# EasyEDA Pro project STM32H723ZGTx_ADDA.eprj, schematic Schematic1

## Sheets
1 STM32: Board Name: Board1; Create Date: 2025-04-22; Page Name: STM32; Project Name: STM32H723ZGTx_ADDA; Schematic Name: Schematic1; Update Date: 2025-05-30; Company: 嘉立创EDA; Page Size: A4; Version: V1.0
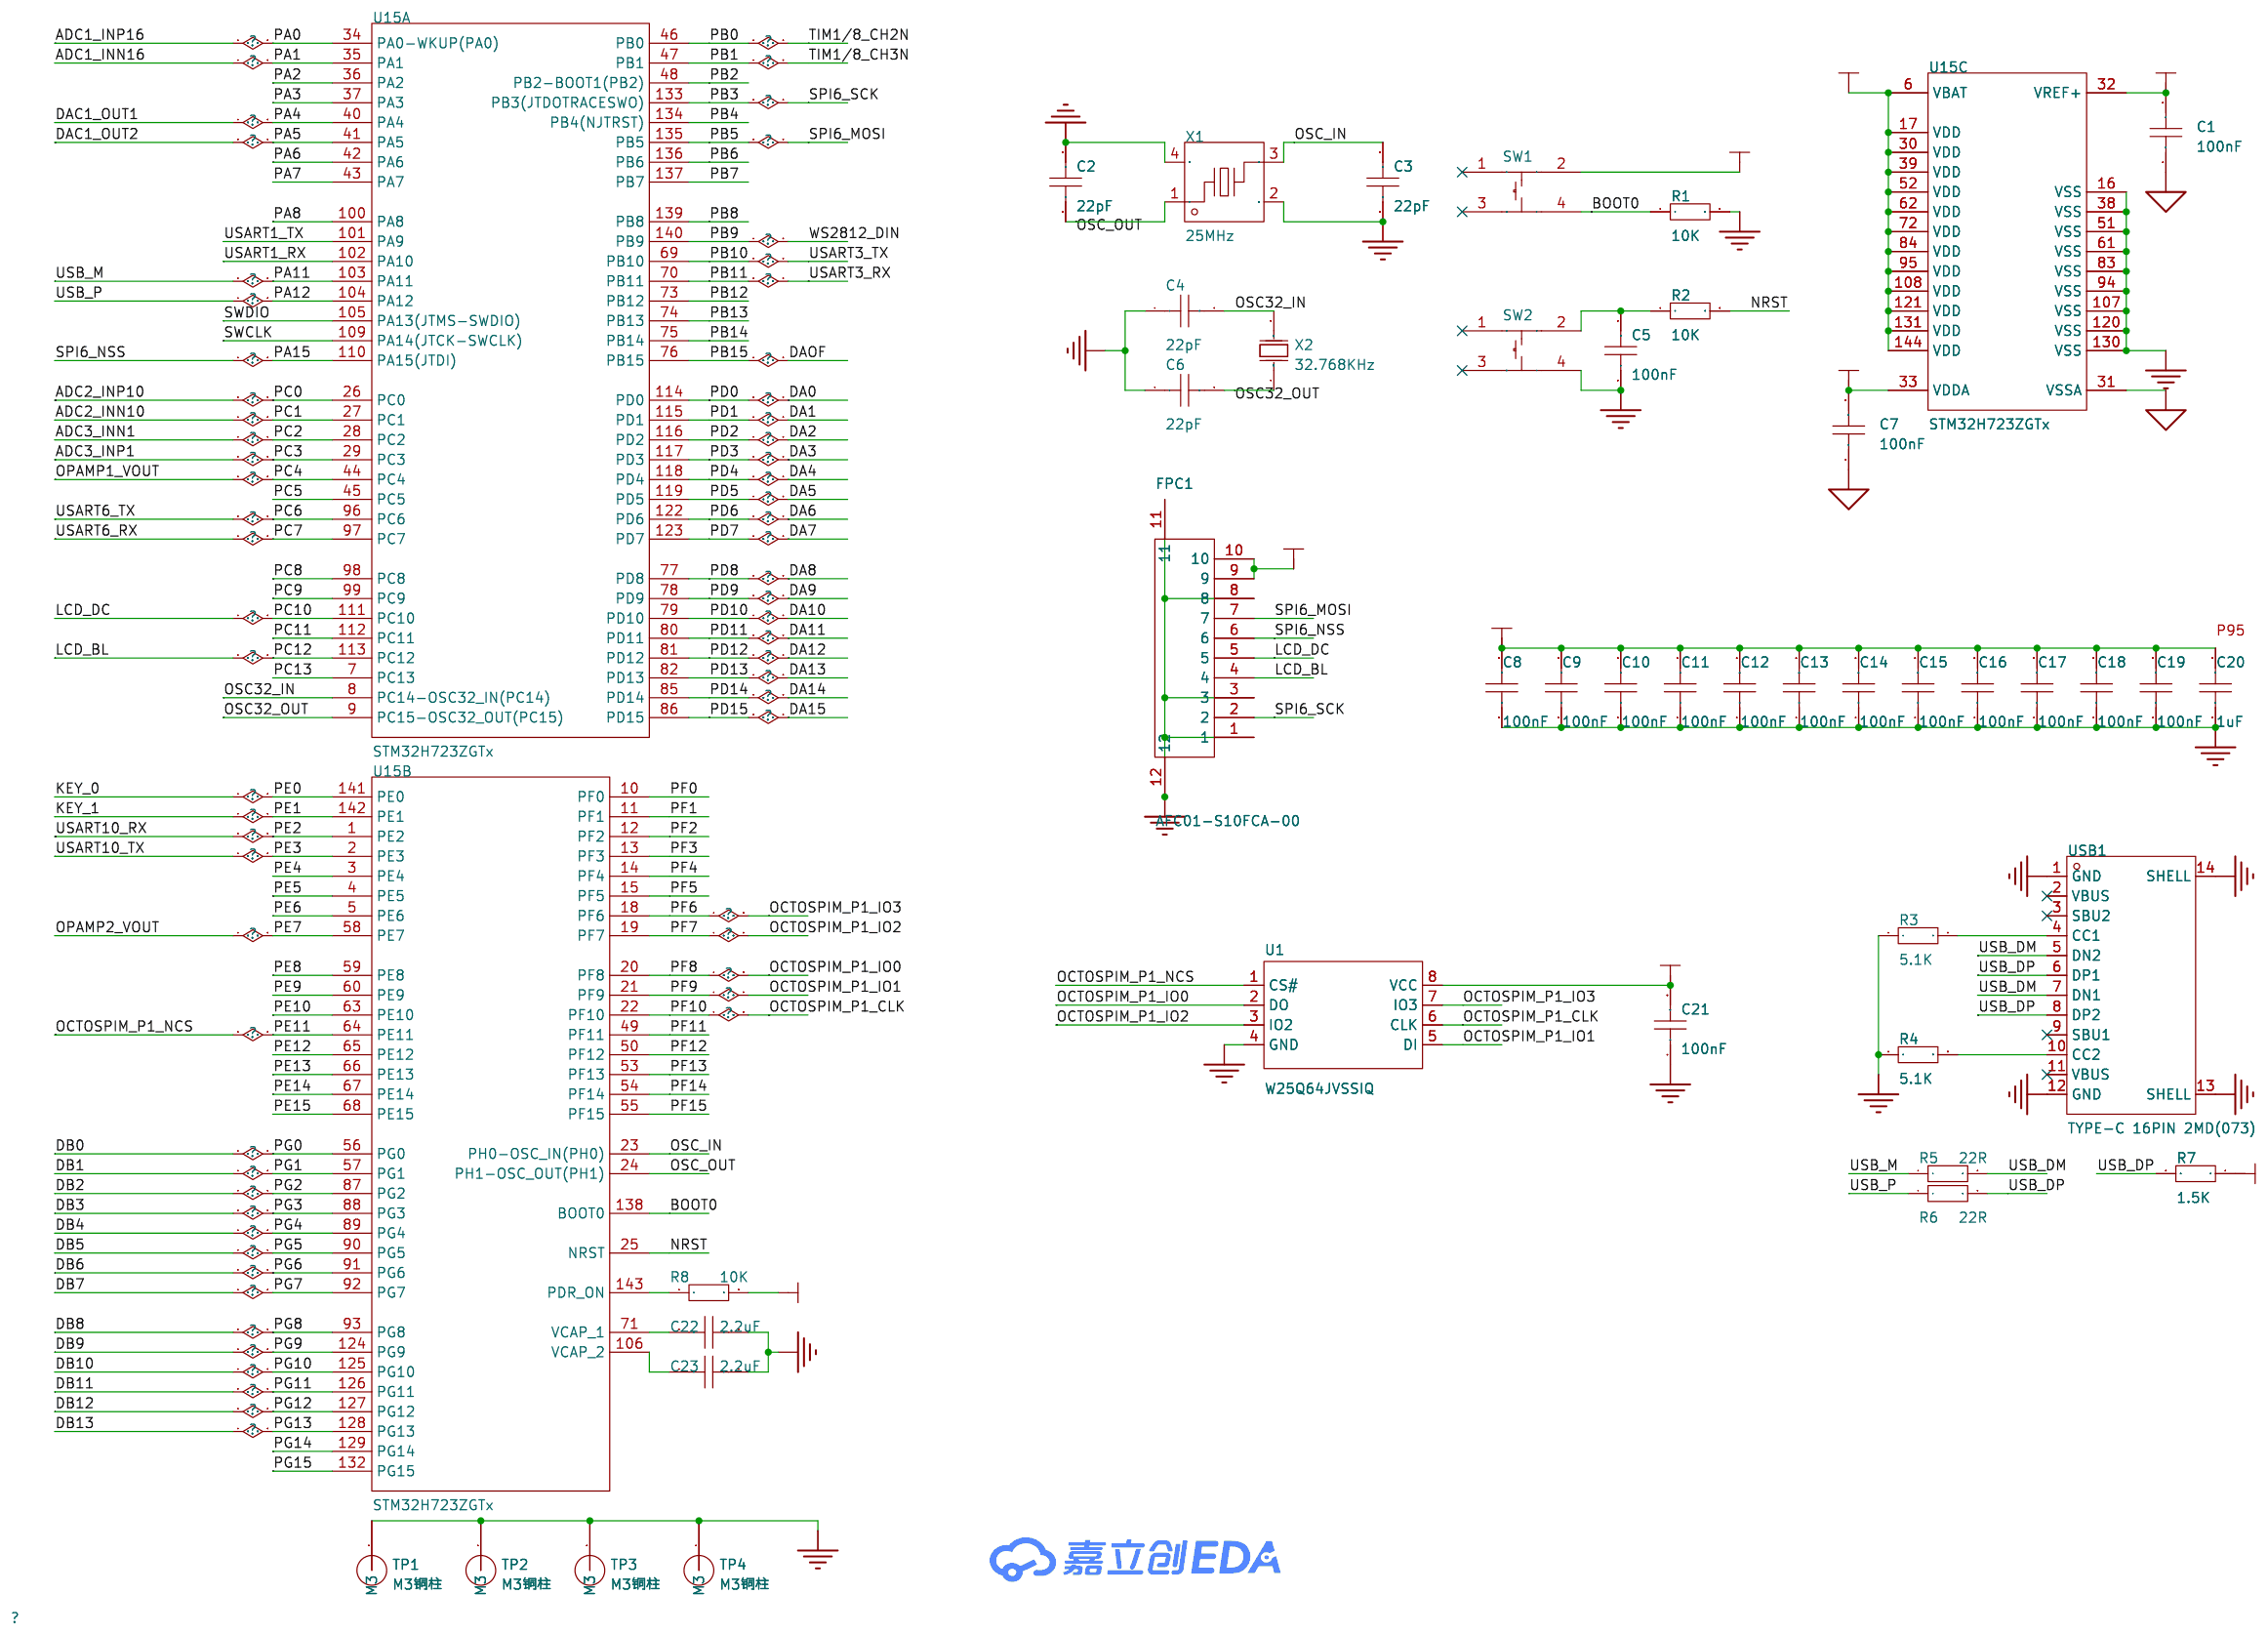
[diagram p0: STM32]
2 POWER: Page Name: POWER; Update Date: 2025-05-24
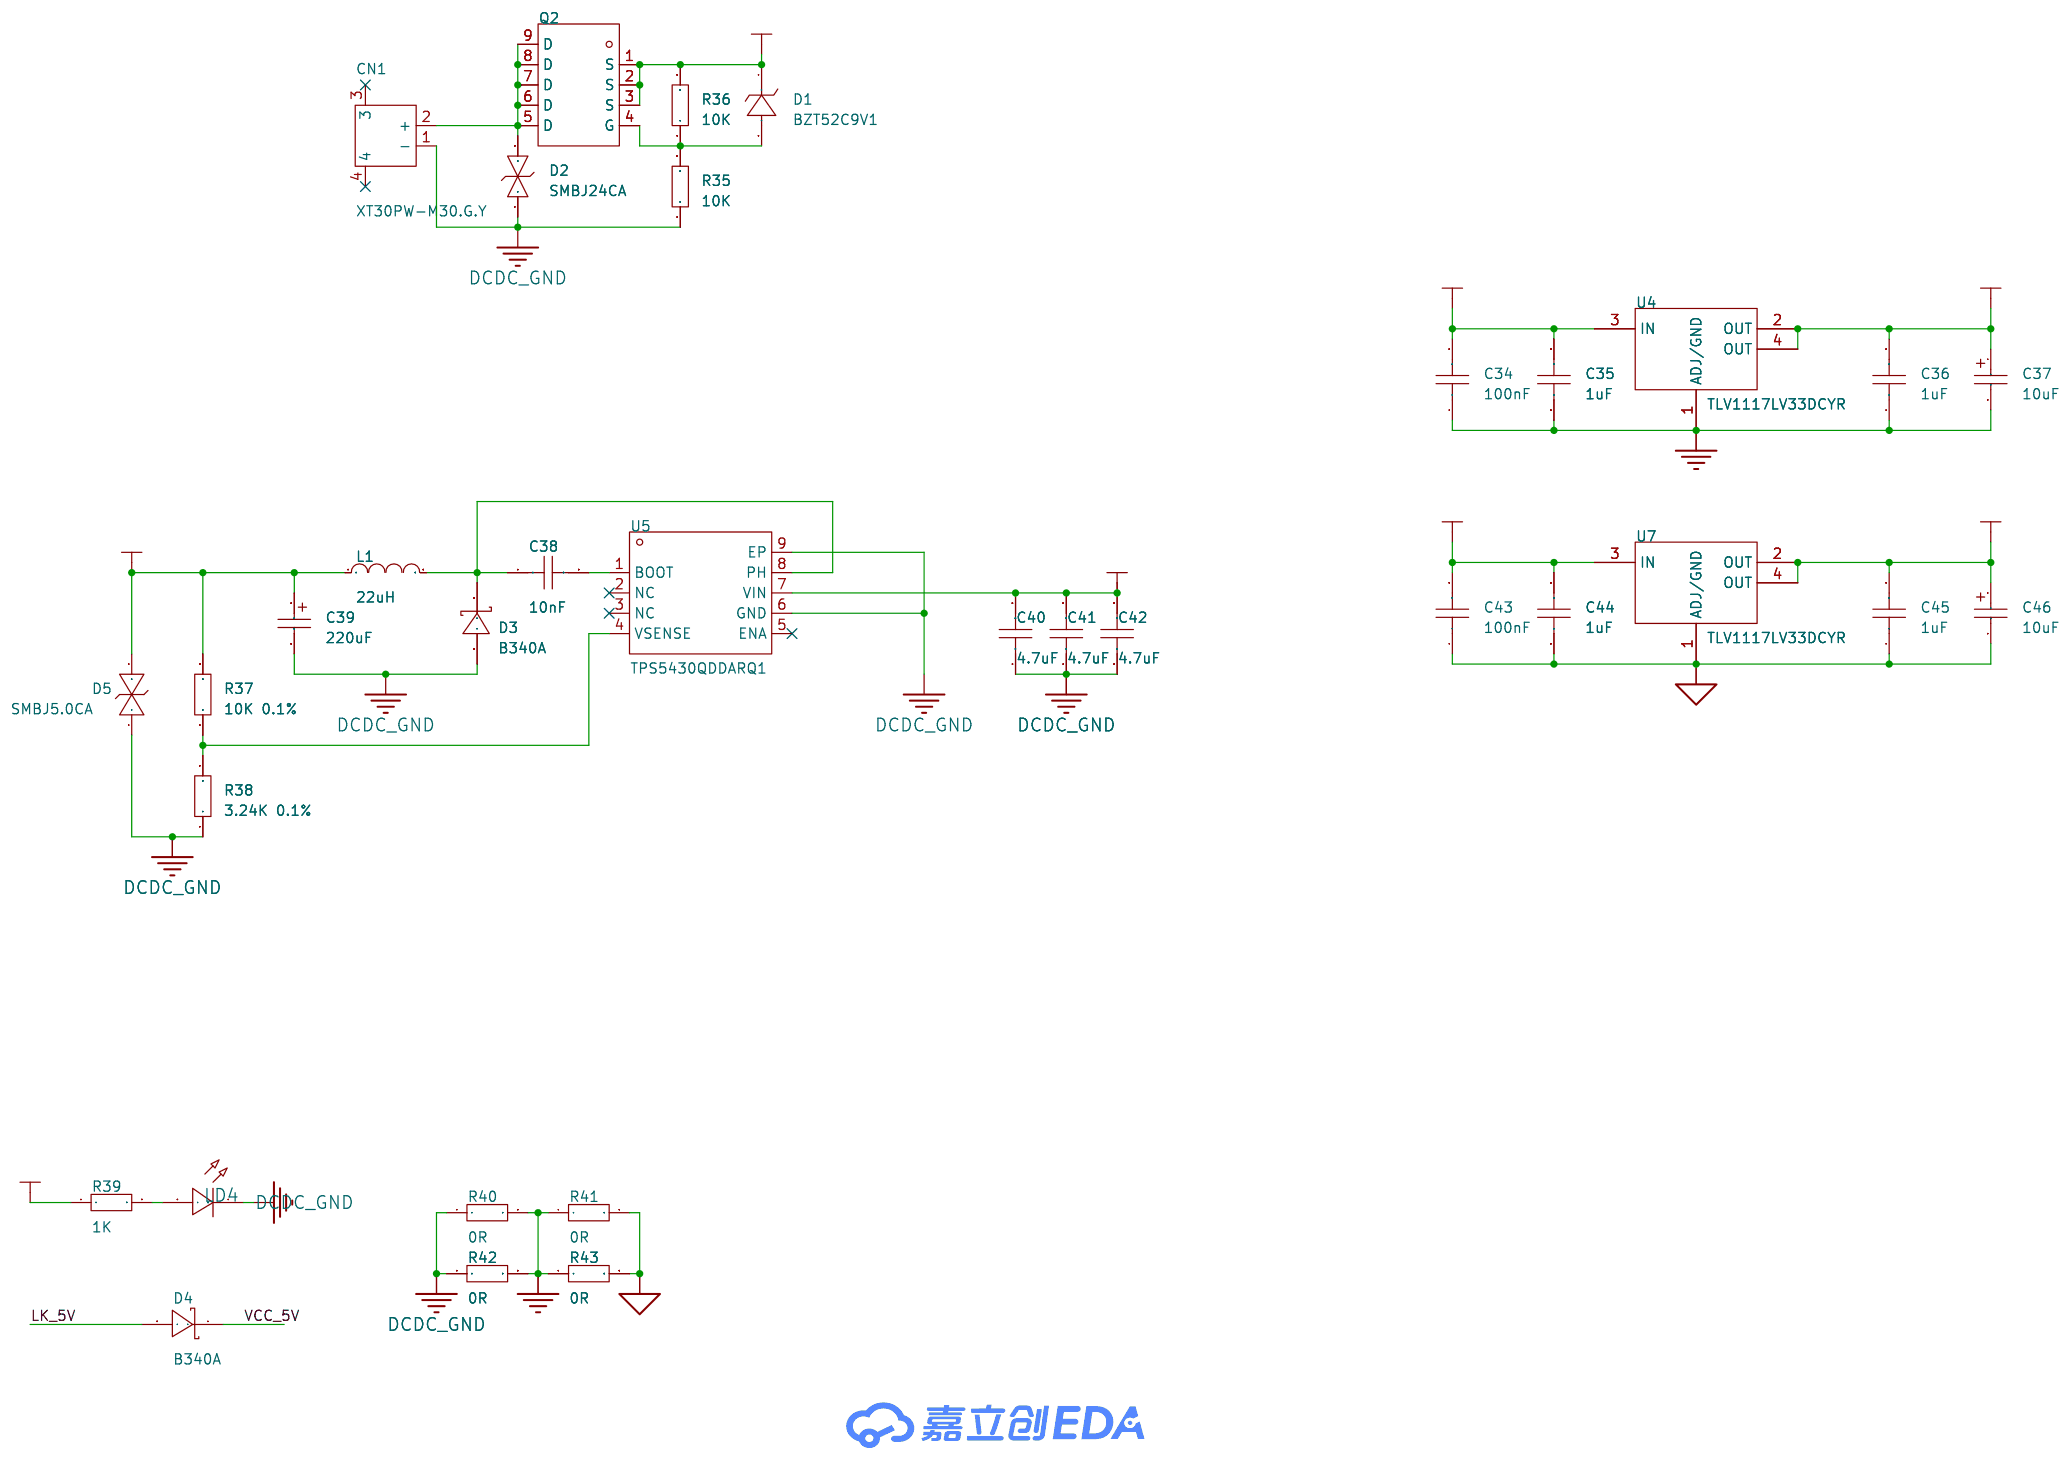
[diagram p1: POWER]
3 ST-LINK: Page Name: ST-LINK; Update Date: 2025-05-06
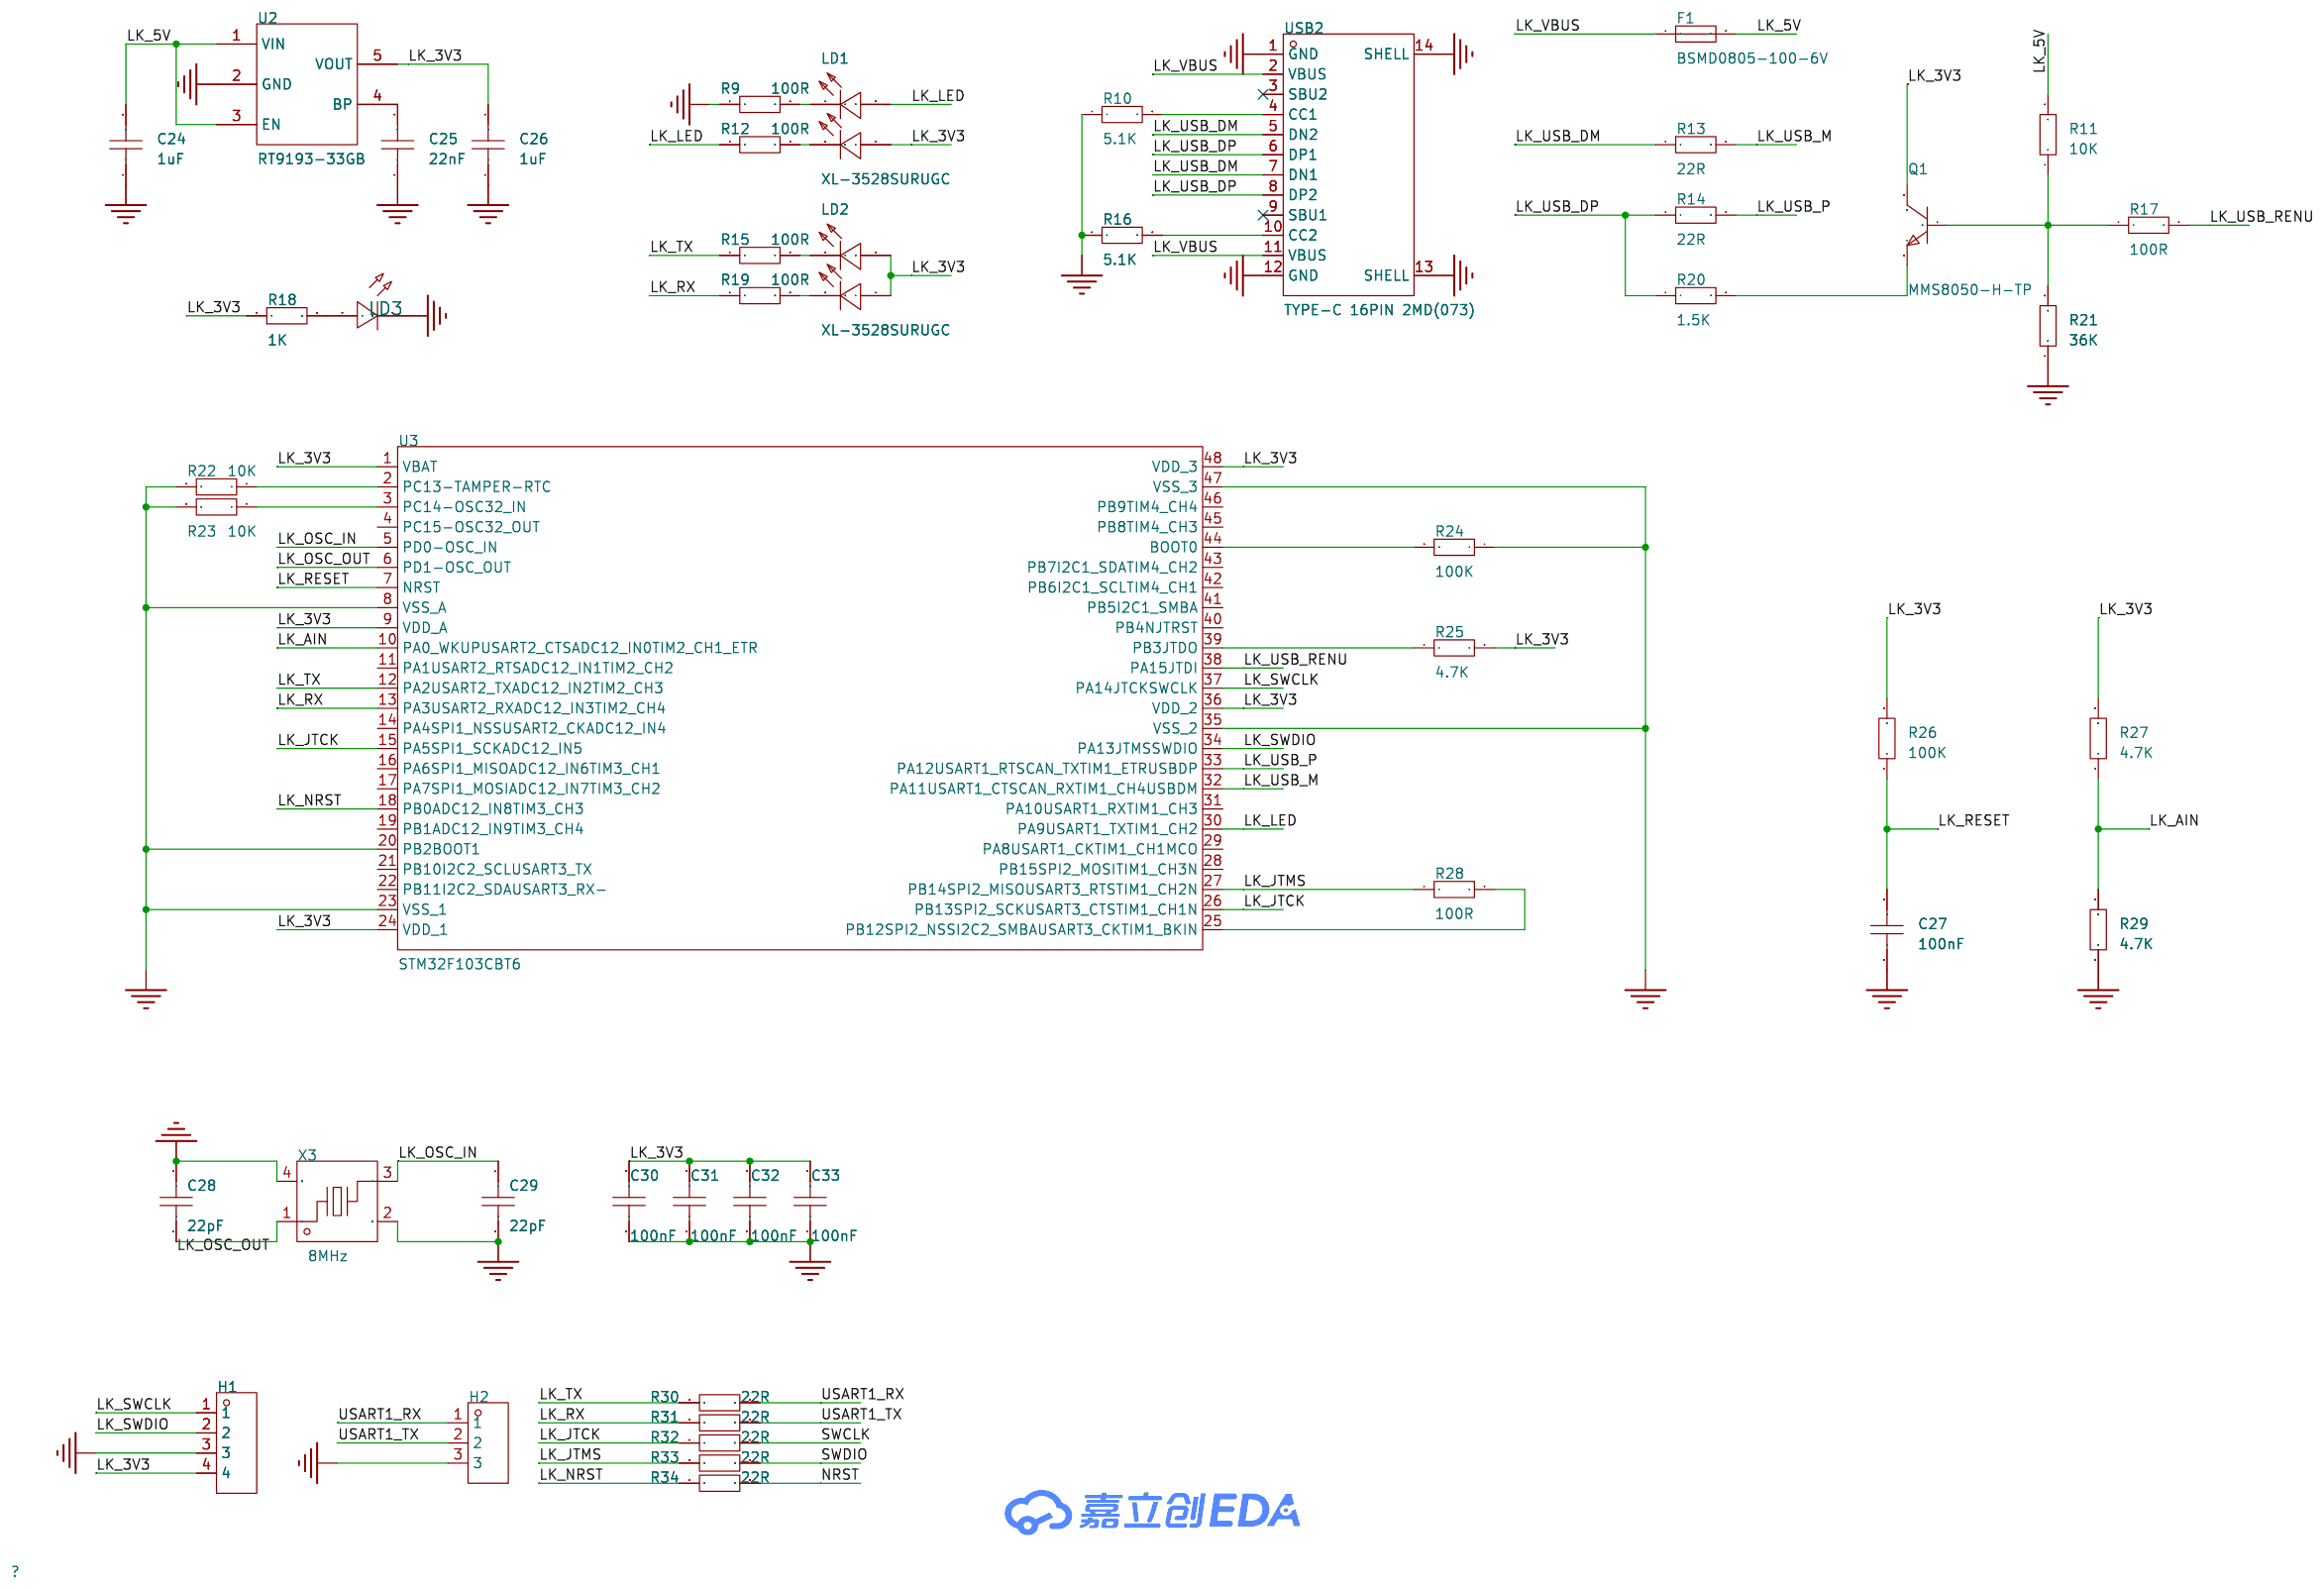
[diagram p2: ST-LINK]
4 PERIPHERAL: Page Name: PERIPHERAL
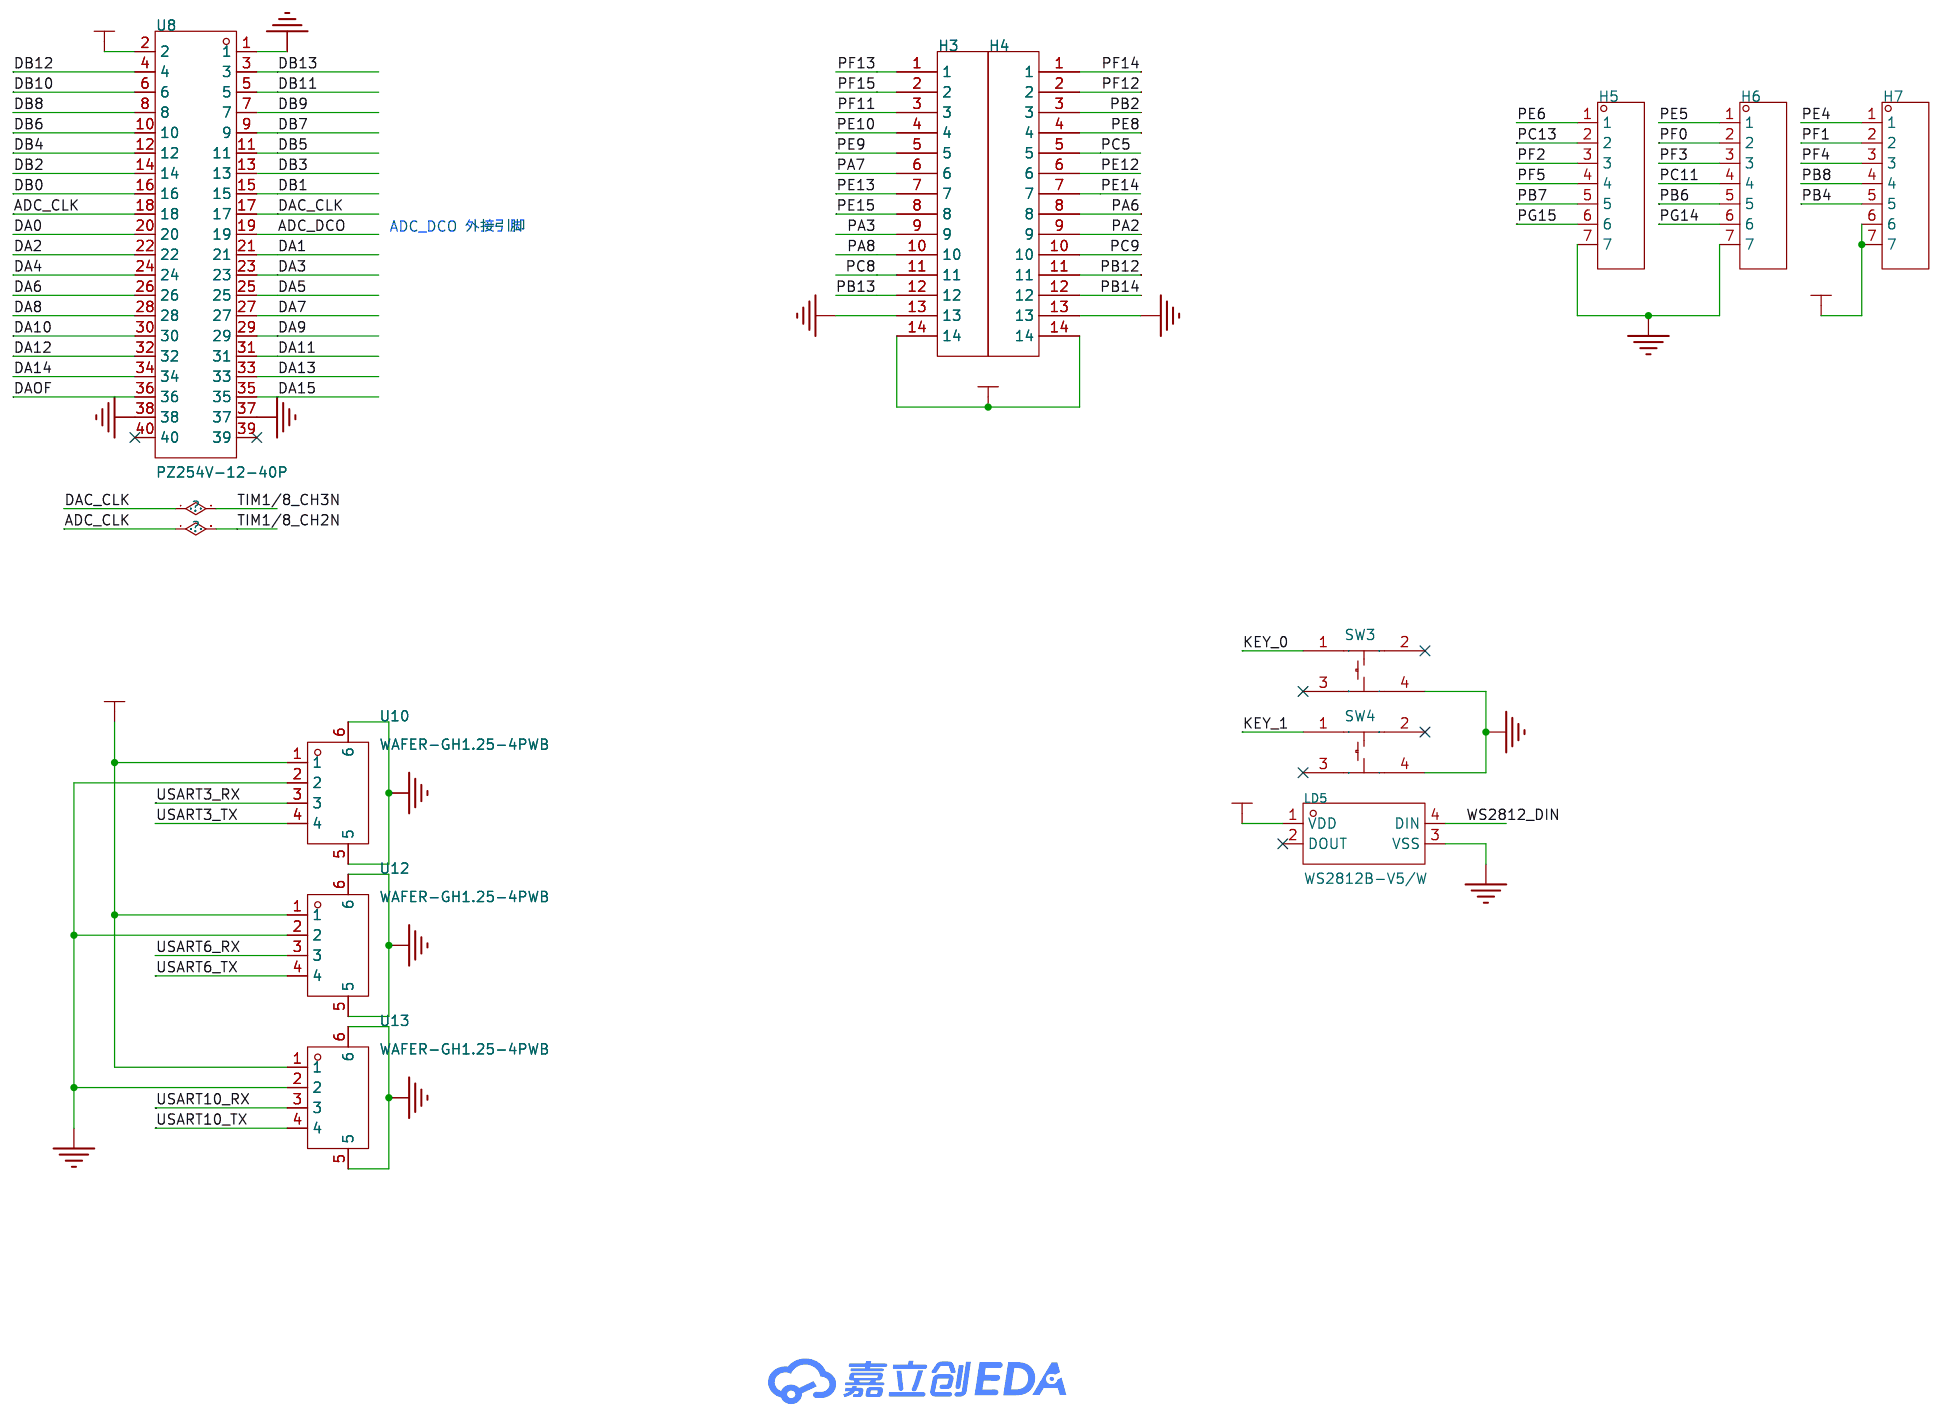
[diagram p3: PERIPHERAL]
5 ADDA: Create Date: 2025-05-05; Page Name: ADDA; Update Date: 2025-05-24
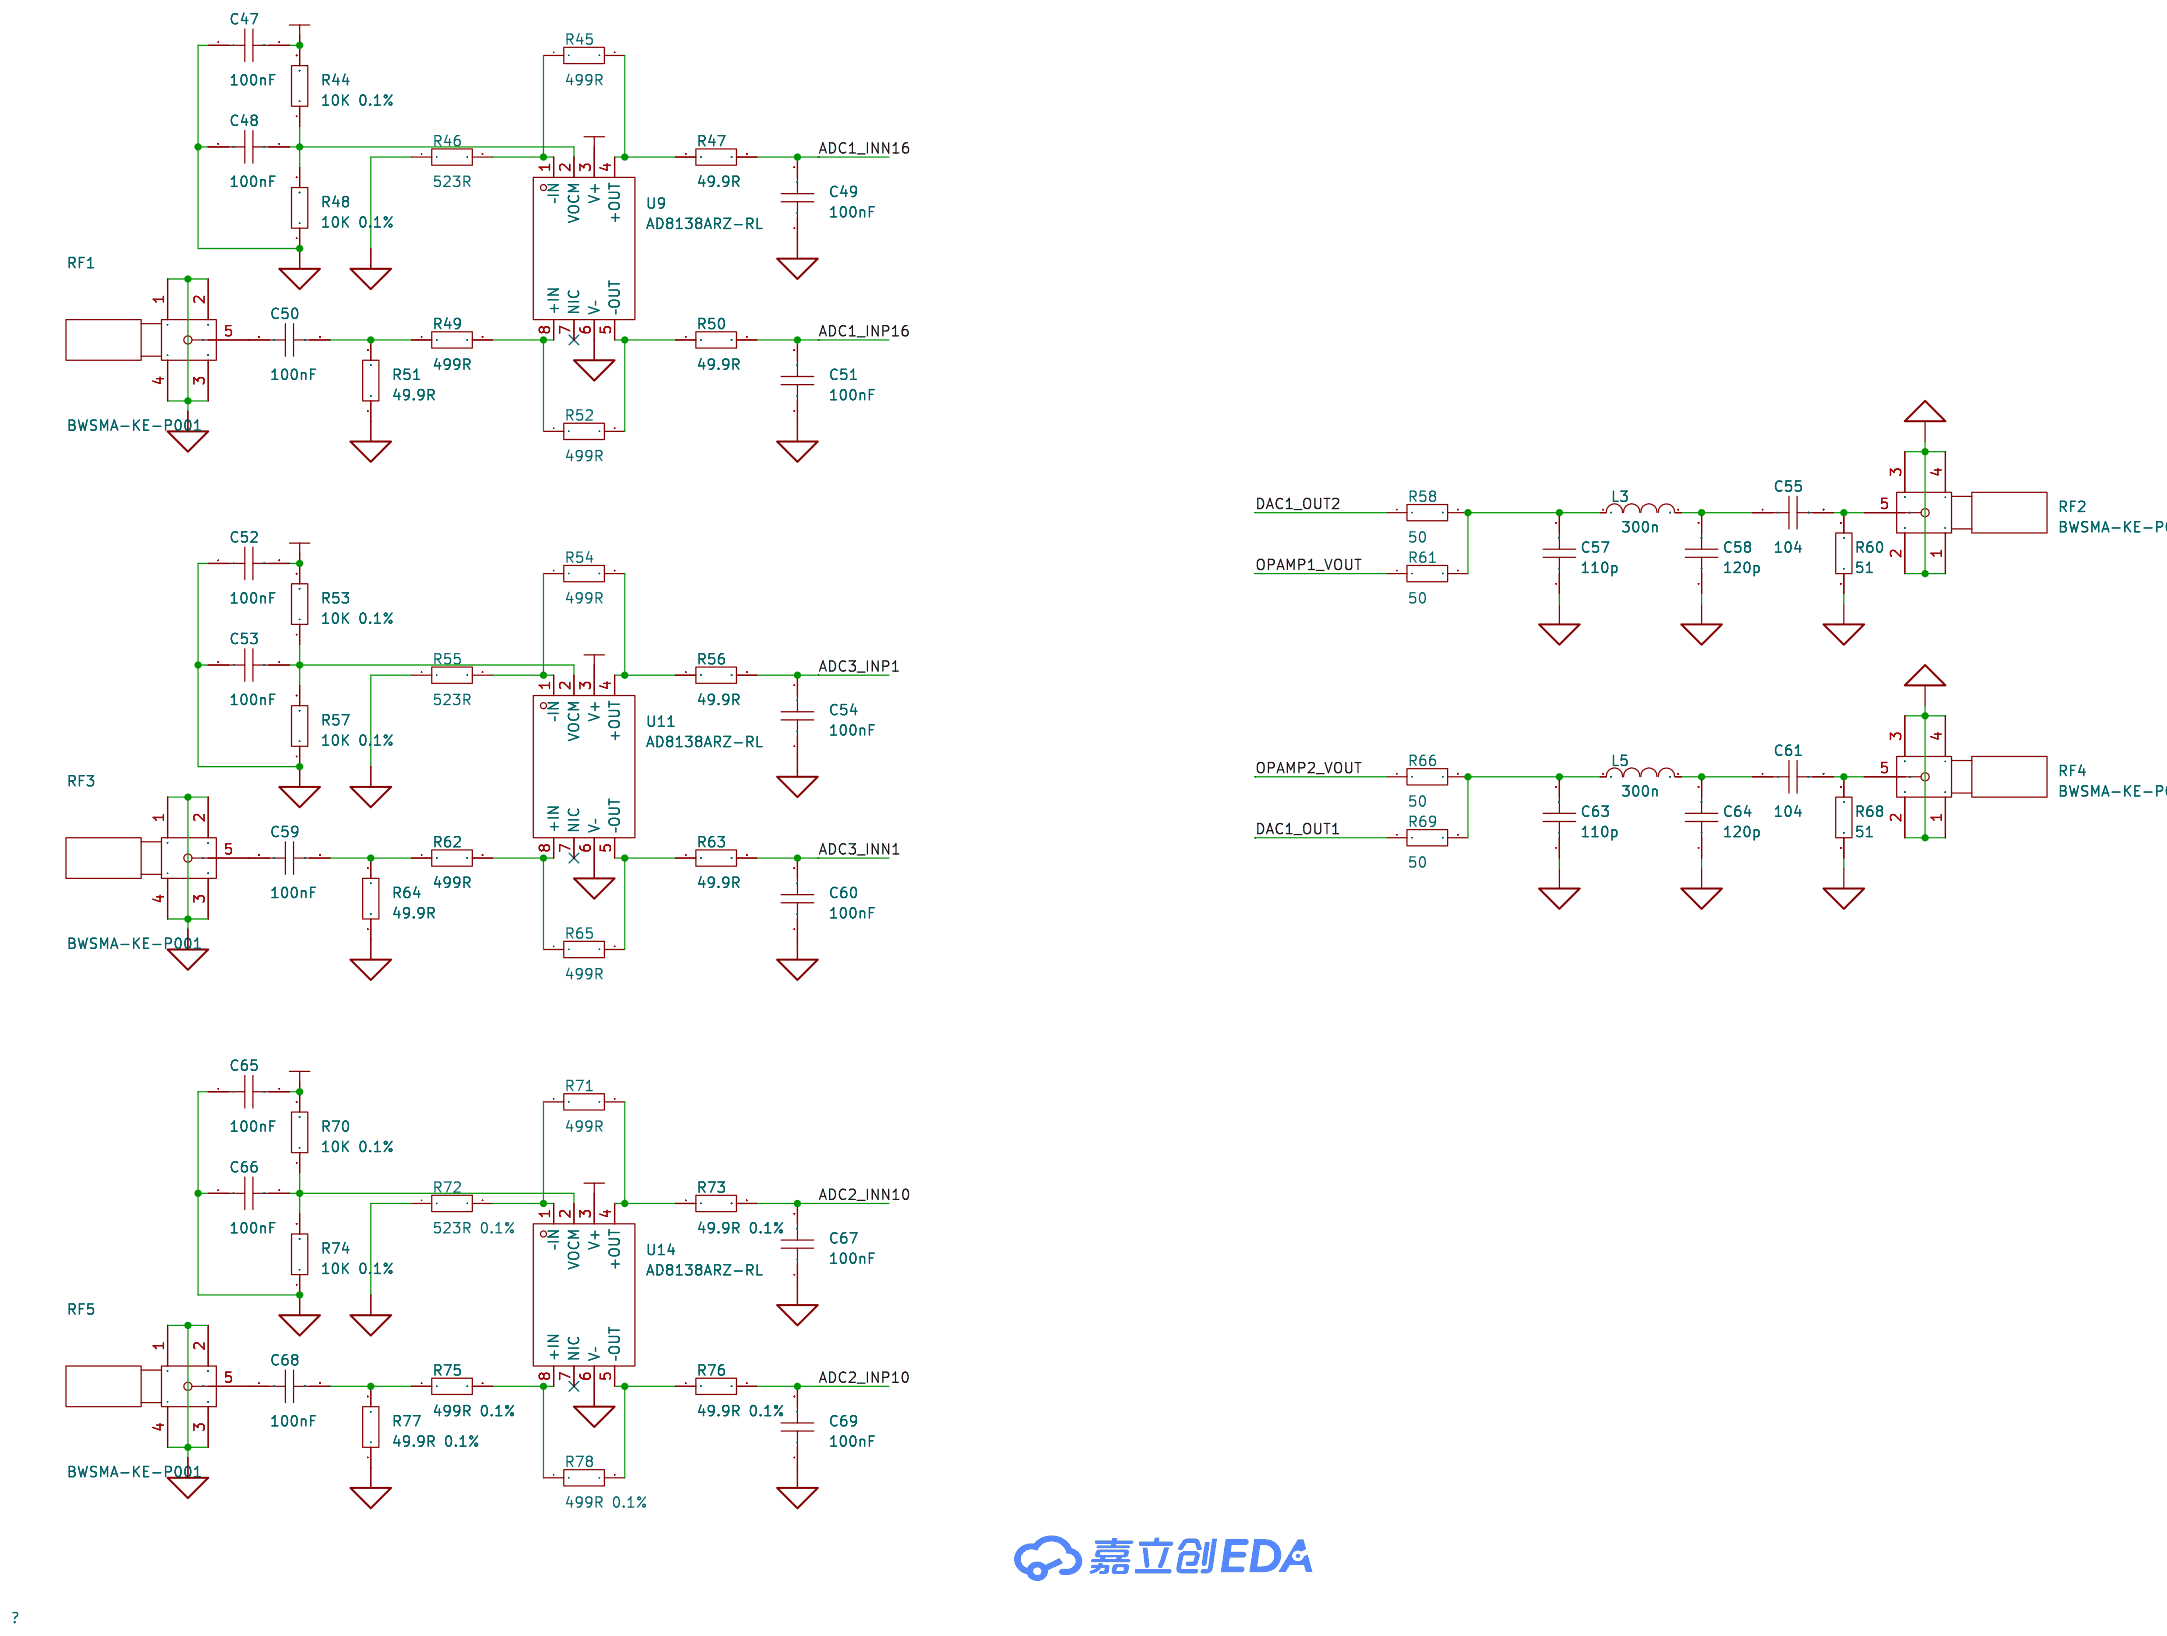
[diagram p4: ADDA]

## Parts
sheet ADDA
C47  100nF  [C0603]
C48  100nF  [C0603]
C49  100nF  [C0603]
C50  100nF  [C0603]
C51  100nF  [C0603]
C52  100nF  [C0603]
C53  100nF  [C0603]
C54  100nF  [C0603]
C55  104  [C0603]
C57  110p  [C0603]
C58  120p  [C0603]
C59  100nF  [C0603]
C60  100nF  [C0603]
C61  104  [C0603]
C63  110p  [C0603]
C64  120p  [C0603]
C65  100nF  [C0603]
C66  100nF  [C0603]
C67  100nF  [C0603]
C68  100nF  [C0603]
C69  100nF  [C0603]
L3  300n  [L0603]
L5  300n  [L0603]
R44  10K 0.1%  [R0603]
R45  499R  [R0603]
R46  523R  [R0603]
R47  49.9R  [R0603]
R48  10K 0.1%  [R0603]
R49  499R  [R0603]
R50  49.9R  [R0603]
R51  49.9R  [R0603]
R52  499R  [R0603]
R53  10K 0.1%  [R0603]
R54  499R  [R0603]
R55  523R  [R0603]
R56  49.9R  [R0603]
R57  10K 0.1%  [R0603]
R58  50  [R0603]
R60  51  [R0603]
R61  50  [R0603]
R62  499R  [R0603]
R63  49.9R  [R0603]
R64  49.9R  [R0603]
R65  499R  [R0603]
R66  50  [R0603]
R68  51  [R0603]
R69  50  [R0603]
R70  10K 0.1%  [R0603]
R71  499R  [R0603]
R72  523R 0.1%  [R0603]
R73  49.9R 0.1%  [R0603]
R74  10K 0.1%  [R0603]
R75  499R 0.1%  [R0603]
R76  49.9R 0.1%  [R0603]
R77  49.9R 0.1%  [R0603]
R78  499R 0.1%  [R0603]
RF1  BWSMA-KE-P001  [SMA-SMD_BWSMA-KE-P001]
RF2  BWSMA-KE-P001  [SMA-SMD_BWSMA-KE-P001]
RF3  BWSMA-KE-P001  [SMA-SMD_BWSMA-KE-P001]
RF4  BWSMA-KE-P001  [SMA-SMD_BWSMA-KE-P001]
RF5  BWSMA-KE-P001  [SMA-SMD_BWSMA-KE-P001]
U9  AD8138ARZ-RL  [SOIC-8_L5.0-W4.0-P1.27-LS6.0-BL]
U11  AD8138ARZ-RL  [SOIC-8_L5.0-W4.0-P1.27-LS6.0-BL]
U14  AD8138ARZ-RL  [SOIC-8_L5.0-W4.0-P1.27-LS6.0-BL]
sheet PERIPHERAL
H3  -  [HDR-TH_14P-P2.54-V-F-1]
H4  -  [HDR-TH_14P-P2.54-V-F-1]
H5  -  [HDR-TH_7P-P2.54-V-F]
H6  -  [HDR-TH_7P-P2.54-V-F]
H7  -  [HDR-TH_7P-P2.54-V-F]
LD5  WS2812B-V5/W  [LED-SMD_4P-L5.0-W5.0-TL-1]
SW3  K2-1808SN-A3SW-01  [SW-SMD_4P-L4.2-W3.3-P2.15-LS5.1]
SW4  K2-1808SN-A3SW-01  [SW-SMD_4P-L4.2-W3.3-P2.15-LS5.1]
U8  PZ254V-12-40P  [HDR-TH_40P-P2.54-V-M-R2-C20-S2.54_2-146257-0]
U10  WAFER-GH1.25-4PWB  [CONN-SMD_4P-P1.25_XUNPU_WAFER-GH1.25-4PWB]
U12  WAFER-GH1.25-4PWB  [CONN-SMD_4P-P1.25_XUNPU_WAFER-GH1.25-4PWB]
U13  WAFER-GH1.25-4PWB  [CONN-SMD_4P-P1.25_XUNPU_WAFER-GH1.25-4PWB]
sheet POWER
C34  100nF  [C0603]
C35  1uF  [C0603]
C36  1uF  [C0603]
C37  10uF  [CAP-SMD_L3.2-W1.6-RD-C7171]
C38  10nF  [C0603]
C39  220uF  [CASE-B_3528]
C40  4.7uF  [C1210]
C41  4.7uF  [C1210]
C42  4.7uF  [C1210]
C43  100nF  [C0603]
C44  1uF  [C0603]
C45  1uF  [C0603]
C46  10uF  [CAP-SMD_L3.2-W1.6-RD-C7171]
CN1  XT30PW-M30.G.Y  [CONN-TH_XT30PW-M]
D1  BZT52C9V1  [SOD-123_L2.7-W1.6-LS3.7-RD]
D2  SMBJ24CA  [SMB_L4.6-W3.6-LS5.4-BI]
D3  B340A  [SMA_L4.3-W2.6-LS5.1-RD]
D4  B340A  [SMA_L4.3-W2.6-LS5.1-RD]
D5  SMBJ5.0CA  [SMB_L4.5-W3.6-LS5.2-BI]
L1  22uH  [IND-SMD_L7.0-W6.6_FXL0630]
LD4  -  [LED_0603]
Q2  HYG110P04LQ2C2  [PDFN-8_L5.2-W5.9-P1.27-LS6.2-BL]
R35  10K  [R0603]
R36  10K  [R0603]
R37  10K 0.1%  [R0603]
R38  3.24K 0.1%  [R0603]
R39  1K  [R0603]
R40  0R  [R0603]
R41  0R  [R0603]
R42  0R  [R0603]
R43  0R  [R0603]
U4  TLV1117LV33DCYR  [SOT-223_L6.7-W3.5-P2.30-BR]
U5  TPS5430QDDARQ1  [SOPOWERPAD-8_L4.9-W3.9-P1.27-LS6.0-BL-EP]
U7  TLV1117LV33DCYR  [SOT-223_L6.7-W3.5-P2.30-BR]
sheet ST-LINK
C24  1uF  [C0603]
C25  22nF  [C0603]
C26  1uF  [C0603]
C27  100nF  [C0603]
C28  22pF  [C0603]
C29  22pF  [C0603]
C30  100nF  [C0603]
C31  100nF  [C0603]
C32  100nF  [C0603]
C33  100nF  [C0603]
F1  BSMD0805-100-6V  [F0805]
H1  -  [HDR-TH_4P-P2.54-V-F]
H2  -  [HDR-TH_3P-P2.54-V-F]
LD1  XL-3528SURUGC  [LED-SMD_4P-L3.2-W2.8-LS3.5-TL]
LD2  XL-3528SURUGC  [LED-SMD_4P-L3.2-W2.8-LS3.5-TL]
LD3  -  [LED_0603]
Q1  MMS8050-H-TP  [SOT-23-3_L2.9-W1.3-P1.90-LS2.4-BR]
R9  100R  [R0603]
R10  5.1K  [R0603]
R11  10K  [R0603]
R12  100R  [R0603]
R13  22R  [R0603]
R14  22R  [R0603]
R15  100R  [R0603]
R16  5.1K  [R0603]
R17  100R  [R0603]
R18  1K  [R0603]
R19  100R  [R0603]
R20  1.5K  [R0603]
R21  36K  [R0603]
R22  10K  [R0603]
R23  10K  [R0603]
R24  100K  [R0603]
R25  4.7K  [R0603]
R26  100K  [R0603]
R27  4.7K  [R0603]
R28  100R  [R0603]
R29  4.7K  [R0603]
R30  22R  [R0603]
R31  22R  [R0603]
R32  22R  [R0603]
R33  22R  [R0603]
R34  22R  [R0603]
U2  RT9193-33GB  [SOT-23-5_L3.0-W1.7-P0.95-LS2.8-BL]
U3  STM32F103CBT6  [LQFP-48_L7.0-W7.0-P0.50-LS9.0-BL]
USB2  TYPE-C 16PIN 2MD(073)  [USB-C-SMD_TYPE-C-6PIN-2MD-073]
X3  8MHz  [OSC-SMD_4P-L3.2-W2.5-BL]
sheet STM32
C1  100nF  [C0603]
C2  22pF  [C0603]
C3  22pF  [C0603]
C4  22pF  [C0603]
C5  100nF  [C0603]
C6  22pF  [C0603]
C7  100nF  [C0603]
C8  100nF  [C0603]
C9  100nF  [C0603]
C10  100nF  [C0603]
C11  100nF  [C0603]
C12  100nF  [C0603]
C13  100nF  [C0603]
C14  100nF  [C0603]
C15  100nF  [C0603]
C16  100nF  [C0603]
C17  100nF  [C0603]
C18  100nF  [C0603]
C19  100nF  [C0603]
C20  1uF  [C0603]
C21  100nF  [C0603]
C22  2.2uF  [C0603]
C23  2.2uF  [C0603]
FPC1  AFC01-S10FCA-00  [FPC-SMD_P0.5-10P_FGS-XJ-H2.0]
R1  10K  [R0603]
R2  10K  [R0603]
R3  5.1K  [R0603]
R4  5.1K  [R0603]
R5  22R  [R0603]
R6  22R  [R0603]
R7  1.5K  [R0603]
R8  10K  [R0603]
SW1  K2-1808SN-A3SW-01  [SW-SMD_4P-L4.2-W3.3-P2.15-LS5.1]
SW2  K2-1808SN-A3SW-01  [SW-SMD_4P-L4.2-W3.3-P2.15-LS5.1]
TP1  M3铜柱  [M3铜柱_LCEDA]
TP2  M3铜柱  [M3铜柱_LCEDA]
TP3  M3铜柱  [M3铜柱_LCEDA]
TP4  M3铜柱  [M3铜柱_LCEDA]
U1  W25Q64JVSSIQ  [SOP-8_L5.3-W5.3-P1.27-LS8.0-BL]
U15  STM32H723ZGTx  [LQFP-144_L20.0-W20.0-P0.50-LS22.0-BL]  (sections 1,2,3)
USB1  TYPE-C 16PIN 2MD(073)  [USB-C-SMD_TYPE-C-6PIN-2MD-073]
X1  25MHz  [OSC-SMD_4P-L3.2-W2.5-BL]
X2  32.768KHz  [OSC-SMD_L3.2-W1.5]

## Library data of the parts
C1-C36 C38 C43-C45 C47-C54 C59 C60 C65-C69 = CAP_0603: Supplier Footprint: 0603
C55 C57 C58 C61 C63 C64 = CC0603KRX7R9BB104: 容值:100nF;精度:±10%;额定电压:50V;材质(温度系数):X7R;; LCSC Part Name: 100nF ±10% 50V; Supplier Part: C14663; Manufacturer: YAGEO(国巨); Supplier Footprint: 0603; JLCPCB Part Class: Basic Part; Datasheet: https://atta.szlcsc.com/upload/public/pdf/source/20180910/C282072_33301C7F631E79921B82A8DAC6BCC5B3.pdf; Supplier: LCSC; Tolerance: ±10%; Voltage Rated: 50V; Temperature Coefficient: X7R
L3 L5 = MCL1608S100MT: 电感值:10uH;精度:±20%;额定电流:50mA;饱和电流(Isat):-;直流电阻(DCR):1.17Ω;; LCSC Part Name: 10uH ±20%; Supplier Part: C51942; Manufacturer: Sunlord(顺络); Supplier Footprint: 0603; JLCPCB Part Class: Extended Part; Datasheet: https://atta.szlcsc.com/upload/public/pdf/source/20231027/47B90BCEA723166BB28D321EF6DEDC57.pdf; Supplier: LCSC; Tolerance: ±20%; Rated Current: 50mA; DC Resistance (DCR): 1.17Ω; Frequency - Self Resonant: 20MHz
R1-R58 R61-R66 R69-R78 = Res_0603: Supplier Footprint: 0603
R60 R68 = 0603WAF1002T5E: 电阻类型:厚膜电阻;阻值:10kΩ;精度:±1%;功率:100mW;最大工作电压:75V;温度系数:±100ppm/℃;; LCSC Part Name: 厚膜电阻 10kΩ ±1% 100mW; Supplier Part: C25804; Manufacturer: UNI-ROYAL(厚声); Supplier Footprint: 0603; JLCPCB Part Class: Basic Part; Datasheet: https://atta.szlcsc.com/upload/public/pdf/source/20200306/C422600_1E6D84923E4A46A82E41ADD87F860B5C.pdf; Supplier: LCSC; Type: 厚膜电阻; Tolerance: ±1%; Power(Watts): 100mW; Overload Voltage (Max): 75V; Temperature Coefficient: ±100ppm/℃; Operating Temperature Range: -55℃~+155℃
RF1-RF5 = BWSMA-KE-P001: LCSC Part Name: 内孔 SMA 偏脚; Supplier Part: C496550; Manufacturer: BAT WIRELESS(蝙蝠无线); Supplier Footprint: SMD; JLCPCB Part Class: 扩展库; Datasheet: https://atta.szlcsc.com/upload/public/pdf/source/20240320/28FD502871C976DFF213ABFCF2A0ED51.pdf; Supplier: LCSC; Connector Type: 板端; Interface Type: 内孔; Number of Ports: 1; Interface Diameter: 5.2mm; RF Series: SMA; Impedance: 50Ω; Style: 偏脚
U9 U11 U14 = AD8138ARZ-RL: LCSC Part Name: 低失真差分ADC驱动器; Supplier Part: C652360; Manufacturer: ADI(亚德诺); Supplier Footprint: SOIC-8; JLCPCB Part Class: 扩展库; Datasheet: https://atta.szlcsc.com/upload/public/pdf/source/20181012/C116011_0AC99E88246DC0EB027D01E9C456B8D0.pdf; Supplier: LCSC; Number of Circuits: 单路; Common Mode Rejection Ratio (CMRR): 77dB; Current - Input Bias(Ib): 500nA; Voltage - Input Offset(Vos): 1mV; Slew Rate(SR): 1150V/us; Supply Voltage: 3V~5V; -3db Bandwidth: 320MHz; Output Current: 95mA; Input Offset Voltage Drift (Vos TC): 4uV/℃; Supply Current: 20mA; Operating Temperature: -40℃~+85℃
H3 H4 = HDR-F-2.54_1x14P: Supplier Part: C52711; Supplier Footprint: 插件
H5-H7 = HDR-F_2.54_1x7P: Supplier Part: C124418; Supplier Footprint: 插件
LD5 = WS2812B-V5/W: 无需外围元器件，有反接保护和过压保护，游乐设备，消费类电子，电竞领域，电脑周边及设备; LCSC Part Name: RGB三色 （注意防潮，请查阅规格书中对应具体内容）; Supplier Part: C2874885; Manufacturer: worldsemi; Supplier Footprint: SMD5050; JLCPCB Part Class: Extended Part; Datasheet: https://atta.szlcsc.com/upload/public/pdf/source/20220607/7C249E7978D02183621563743847A955.pdf; Supplier: LCSC
SW1-SW4 = K2-1808SN-A3SW-01: 触点电流:50mA;额定电压(DC):12V;绝缘电阻:100MΩ;安装方式:立贴;作用力:180gf@±30gf;机械寿命:100000;工作温度:-25℃~+85℃;开关长度:4.2mm;开关宽度:3.25mm;开关高度:2.5mm;; LCSC Part Name: 3*4*2.5 贴片开关180G; Supplier Part: C2690012; Manufacturer: 韩国韩荣; Supplier Footprint: SMD; JLCPCB Part Class: Extended Part; Datasheet: https://atta.szlcsc.com/upload/public/pdf/source/20180927/C283535_7E7907F3E7B6C1691E1DC87E363D082A.pdf; Supplier: LCSC; Contact Current: 50mA; Voltage Rating (DC): 12V; Insulation Resistance: 100MΩ; Mounting Sytle: 立贴; Operating Force: 180gf@±30gf; Mechanical Life: 100000; Operating Temperature: -25℃~+85℃; Switch Length: 4.2mm; Switch Width: 3.25mm; Switch Height: 2.5mm
U8 = PZ254V-12-40P: LCSC Part Name: 排针2.54mm间距 双排 2x20P 直插 方针; Supplier Part: C22465944; Manufacturer: XFCN(兴飞); Supplier Footprint: 插件,P=2.54mm; JLCPCB Part Class: 扩展库; Datasheet: https://atta.szlcsc.com/upload/public/pdf/source/20240617/7BDC3EEBCF4C501A0924363F71CB3FB4.pdf; Supplier: LCSC
U10 U12 U13 = WAFER-GH1.25-4PWB: LCSC Part Name: 1x4P 间距:1.25mm 卧贴 系列:GH; Supplier Part: C3029379; Manufacturer: XUNPU(讯普); Supplier Footprint: SMD,P=1.25mm,卧贴; JLCPCB Part Class: 扩展库; Datasheet: https://atta.szlcsc.com/upload/public/pdf/source/20220527/CB8773BFB0913C3B8ABD62CB38BA101A.pdf; Supplier: LCSC; Pins Structure: 1x4P; Pitch: 1.25mm; Mounting Type: 卧贴; Reference Series: GH; Number of Pins: 4P; Number of Rows: 1; Number of PINs Per Row: 4; Current Rating: 1A; Contact Material: 黄铜; Operating Temperature: -25℃~+85℃; Voltage Rating: 125V; Plastic Material: LCP; Supplementary Features: 辅助焊脚; Color: 米色; Z-Height of the Board: 4.35mm; X-Length of Bottom Edge on Board (Spacing Line): 8.25mm; Y-Width of Bottom Edge on Board: 5mm
C37 C46 = TAJA106K016RNJ: LCSC Part Name: 10uF ±10% 16V; Supplier Part: C7171; Manufacturer: Kyocera AVX; Supplier Footprint: CASE-A-3216-18(mm); JLCPCB Part Class: 基础库; Supplier: LCSC; Tolerance: ±10%; Voltage Rating: 16V; Equivalent Series Resistance(ESR): 3Ω@100kHz; Operating Temperature: -55℃~+125℃
C39 = TLJB227M006R0500: LCSC Part Name: 220uF ±20% 6.3V; Supplier Part: C30242; Manufacturer: Kyocera AVX; Supplier Footprint: CASE-B-3528-21(mm); JLCPCB Part Class: 扩展库; Datasheet: https://atta.szlcsc.com/upload/public/pdf/source/20181016/C313517_95E099C94D57B8A6005DAF15C3058A23.pdf; Supplier: LCSC; Tolerance: ±20%; Rated Voltage: 6.3V; Equivalent Series Resistance(ESR): 500mΩ@100kHz; Operating Temperature: -55℃~+125℃
C40-C42 = FS32X106K101EGG: LCSC Part Name: 10uF ±10% 100V; Supplier Part: C5156756; Manufacturer: PSA(信昌电陶); Supplier Footprint: 1210; JLCPCB Part Class: 扩展库; Datasheet: https://atta.szlcsc.com/upload/public/pdf/source/20220906/2A42A90825742552985FFB5A7BAB200E.pdf; Supplier: LCSC; Tolerance: ±10%; Voltage Rating: 100V; Temperature Coefficient: X7R
CN1 = XT30PW-M30.G.Y: LCSC Part Name: AMASS(艾迈斯)航模插头 卧式弯脚 XT30PW-M公头; Supplier Part: C431092; Manufacturer: AMASS(艾迈斯); JLCPCB Part Class: 扩展库; Datasheet: https://atta.szlcsc.com/upload/public/pdf/source/20220222/6A9F22F7850E25B33E1BE430ADF8560B.pdf; Supplier: LCSC; Type: 航模插头; RatedVoltage: DC 500V; InterfaceType: 公头; RatedCurrent: 15A; RecommendedWireGauge: 16/18/20AWG; contact resistance: 1.2mΩ; specifications: 2pin
D1 = BZT52C9V1_C19077407: Supplier Part: C19077407; Manufacturer: 宏嘉诚; Supplier Footprint: SOD-123; JLCPCB Part Class: 扩展库; Datasheet: https://atta.szlcsc.com/upload/public/pdf/source/20250106/E12AA82D484C9C66E469D005F460C1F7.pdf; Supplier: LCSC; Diode Configuration: 独立式; Zener Voltage(Nom): 9.1V; Reverse Leakage Current (Ir): 500nA@6V; Zener Voltage(Range): 8.65V~9.56V; Pd - Power Dissipation(Pd): 500mW; Impedance(Zzt): 15Ω
D2 = SMBJ24CA_C19077579: Supplier Part: C19077579; Manufacturer: 宏嘉诚; Supplier Footprint: SMB; JLCPCB Part Class: 扩展库; Datasheet: https://atta.szlcsc.com/upload/public/pdf/source/20250107/474F05451FC8AB27D7FA0238914F96F6.pdf; Supplier: LCSC; Polarity: 双向; Reverse Stand-Off Voltage (Vrwm): 24V; Clamping Voltage: 38.9V; Peak Pulse Current (Ipp): 15.42A; Peak Pulse Power Dissipation (Ppp): 600W; Voltage - Breakdown: 26.7V; Reverse Leakage Current (Ir): 5uA; Number of Channels: 单路; Type: TVS
D3 D4 = B340A: LCSC Part Name: 电压:40V 电流:3A; Supplier Part: C64982; Manufacturer: MDD(辰达半导体); Supplier Footprint: SMA(DO-214AC); JLCPCB Part Class: 扩展库; Datasheet: https://atta.szlcsc.com/upload/public/pdf/source/20240710/591710C3B34CDB7FE3DA92C119E6F598.pdf; Supplier: LCSC; Diode Configuration: 独立式; Forward Voltage (Vf@If): 550mV@3A; Reverse Voltage (Vr): 40V; Rectified Current: 3A; Reverse Leakage Current (Ir): 500uA@40V
D5 = SMBJ5.0CA_C19077559: Supplier Part: C19077559; Manufacturer: 宏嘉诚; Supplier Footprint: SMB; JLCPCB Part Class: 扩展库; Datasheet: https://atta.szlcsc.com/upload/public/pdf/source/20250107/474F05451FC8AB27D7FA0238914F96F6.pdf; Supplier: LCSC; Polarity: 双向; Reverse Stand-Off Voltage (Vrwm): 5V; Clamping Voltage: 9.2V; Peak Pulse Current (Ipp): 65.22A; Peak Pulse Power Dissipation (Ppp): 600W; Voltage - Breakdown: 7V; Reverse Leakage Current (Ir): 800uA; Type: TVS
L1 = FXL0630-150-M: LCSC Part Name: 15uH ±20% 4.5A; Supplier Part: C177243; Manufacturer: cjiang(长江微电); Supplier Footprint: SMD,6.6x7mm; JLCPCB Part Class: 扩展库; Datasheet: https://atta.szlcsc.com/upload/public/pdf/source/20240426/3189EA8206330E2108542F9E34E540E7.pdf; Supplier: LCSC; Tolerance: ±20%; Rated Current: 3A; Saturation Current (Isat): 4.5A; DC Resistance (DCR): 115mΩ; Type: 一体成型电感
LD3 LD4 = LED_0603-R: Supplier Footprint: 0603
Q2 = HYG110P04LQ2C2: LCSC Part Name: 单通道P沟道增强型MOSFET,电流:-55A,耐压:-40V; Supplier Part: C2891580; Manufacturer: HUAYI(华羿微); Supplier Footprint: PDFN-8(5.9x5.2); JLCPCB Part Class: 扩展库; Datasheet: https://atta.szlcsc.com/upload/public/pdf/source/20210918/C2891580_F8AA530E8886F11C9EBC9E8EFD99D4C1.pdf; Supplier: LCSC; Type: 1个P沟道; Drain Source Voltage (Vdss): 40V; Continuous Drain Current (Id): 55A; Drain Source On Resistance (RDS(on)@Vgs,Id): 9mΩ@10V; Power Dissipation (Pd): 62.5W; Gate Threshold Voltage (Vgs(th)@Id): 1V@250uA; Total Gate Charge (Qg@Vgs): 76nC; Input Capacitance (Ciss@Vds): 4.468nF; Reverse Transfer Capacitance (Crss@Vds): 140pF@25V; Operating Temperature: -55℃~+175℃
U4 U7 = TLV1117LV33DCYR: LCSC Part Name: 1A 低压降稳压器; Supplier Part: C15578; Manufacturer: TI(德州仪器); Supplier Footprint: SOT-223; JLCPCB Part Class: 扩展库; Datasheet: https://www.ti.com/cn/lit/gpn/tlv1117lv; Supplier: LCSC; Output Type: 固定; Maximum Input Voltage: 5.5V; Output Voltage: 3.3V; Output Current: 1A; Power Supply Rejection Ratio (PSRR): 75dB@(120Hz); Dropout Voltage: 1.3V@(800mA); standby current: 100uA; Feature: 防静电保护；低ESR；热保护(TSD)；过流保护(OCP)；欠压闭锁; Operating Temperature: -40℃~+125℃; Output Polarity: 正极; Number of Outputs: 1
U5 = TPS5430QDDARQ1: LCSC Part Name: 3A宽输入范围降压转换器; Supplier Part: C388178; Manufacturer: TI(德州仪器); Supplier Footprint: SOP-8-EP; JLCPCB Part Class: 扩展库; Datasheet: https://www.ti.com/cn/lit/gpn/tps5430-q1; Supplier: LCSC; Function: 降压型; Output Type: 可调; Input Voltage: 5.5V~36V; Output Voltage: 1.221V~32.04V; Output Current: 3A; Switching Frequency: 500kHz; Operating Temperature: -40℃~+125℃@(TJ); Synchronous Rectification: 否; Number of Outputs: 1; Topology: 降压式; Switch tube (built-in/external): 内置
F1 = BSMD0805-100-6V: 最大电压:6V;最大电流:40A;保持电流:1A;跳闸电流:2A;; LCSC Part Name: 6V 1A 0805自恢复; Supplier Part: C883112; Manufacturer: BHFUSE(佰宏); Supplier Footprint: 0805; JLCPCB Part Class: 扩展库; Datasheet: https://atta.szlcsc.com/upload/public/pdf/source/20230512/7A46D6CD923C15CBB98FD769C08EDD80.pdf; Supplier: LCSC; Operating Voltage (Max): 6V; Current Rating (Max): 40A; Hold Current: 1A; Trip Current: 2A; Power Dissipation: 600mW; Resistance - Initial (Ri) (Min): 40mΩ; Resistance - Post Trip (R1) (Max): 270mΩ; Maximum Time to Trip: 300ms; Operating Temperature: -40℃~+85℃
H1 = HDR-F_2.54_1x4P: Supplier Part: C2718488; Supplier Footprint: 插件
H2 = HDR-F_2.54_1x3P: Supplier Part: C541850; Supplier Footprint: 插件
LD1 LD2 = XL-3528SURUGC: Supplier Part: C2843810; Manufacturer: XINGLIGHT(成兴光); Supplier Footprint: SMD3528; JLCPCB Part Class: 扩展库; Datasheet: https://atta.szlcsc.com/upload/public/pdf/source/20221102/F90D461D3395F167E4A274E460079459.pdf; Supplier: LCSC; Emitted Color: 红色,翠绿色; Power Dissipation: 90mW；90mW; Forward Current: 30mA; Dominant Wavelength: 520nm~522.5nm；620nm~625nm; Peak Wavelength: 522.5nm；625nm; Lens Color: 无色透明透镜; Viewing Angle: 120°; Mounting Sytle: 正贴; Operating Temperature: -30℃~+85℃
Q1 = MMS8050-H-TP: Supplier Part: C668971; Manufacturer: MCC(美微科); Supplier Footprint: SOT-23; JLCPCB Part Class: 扩展库; Datasheet: https://atta.szlcsc.com/upload/public/pdf/source/20200618/C668971_E8C4278A0C61D2294D468F2197C24659.pdf; Supplier: LCSC; type: NPN; Current - Collector(Ic): 500mA; Collector - Emitter Voltage VCEO: 25V; Pd - Power Dissipation: 300mW; DC Current Gain: 120@50mA,1V; Transition frequency(fT): 150MHz; Current - Collector Cutoff: 100nA; Vce Saturation(VCE(sat)): 600mV; Operating Temperature: -55℃~+150℃@(Tj)
U2 = RT9193-33GB: 输出类型:固定;最大输入电压:5.5V;输出电压:3.3V;输出电流:300mA;电源纹波抑制比(PSRR):70dB@(100Hz)；50dB@(10kHz);输出极性:正极;; LCSC Part Name: 输入5.5V 输出3.3V 300mA; Supplier Part: C15651; Manufacturer: RICHTEK(立锜); Supplier Footprint: SOT-23-5; JLCPCB Part Class: 扩展库; Datasheet: https://atta.szlcsc.com/upload/public/pdf/source/20130730/1457706628575.pdf; Supplier: LCSC; Output Type: 固定; Maximum Input Voltage: 5.5V; Output Voltage: 3.3V; Output Current: 300mA; Power Supply Rejection Ratio (PSRR): 70dB@(100Hz)；50dB@(10kHz); Dropout Voltage: 300mV@(300mA); standby current: 130uA; Feature: 防静电保护；低ESR；热保护(TSD)；过流保护(OCP)；带使能; Operating Temperature: -40℃~+125℃; Output Polarity: 正极; Number of Outputs: 1
U3 = STM32F103CBT6: LCSC Part Name: 主流增强型ARM Cortex-M3 MCU，具有128 KB Flash、72 MHz CPU、电机控制、USB和CAN; Supplier Part: C8304; Manufacturer: ST(意法半导体); Supplier Footprint: LQFP-48(7x7); JLCPCB Part Class: 扩展库; Datasheet: https://atta.szlcsc.com/upload/public/pdf/source/20150811/1457707344439.pdf; Supplier: LCSC; CPU Core: ARM-M3; CPU Maximum Speed: 72MHz; Program Storage Size: 128KB; Program Memory Type: FLASH; Number of I/O: 37; ADC (Bit): 12bit; Voltage - Supply: 2V~3.6V
USB1 USB2 = TYPE-C 16PIN 2MD(073): 连接器类型:Type-C;标准:USB 3.1;公母:母;安装方式:卧贴;触点数量:16P;端口数量:1;额定电流 - 电源:5A;工作温度范围:-25℃~+85℃;; LCSC Part Name: Type-C 母 卧贴; Supplier Part: C2765186; Manufacturer: SHOU HAN(首韩); Supplier Footprint: SMD; JLCPCB Part Class: 扩展库; Datasheet: https://atta.szlcsc.com/upload/public/pdf/source/20211123/39B17C16241EAC15C5E277BDA434118E.pdf; Supplier: LCSC; Connector Type: Type-C; Standard: USB 3.1; Gender: 母; Mounting Style: 卧贴; Number of Contacts: 16P; Number of Ports: 1; Current Rating - Power (Max): 5A; Operating Temperature Range: -25℃~+85℃; Rated Voltage (Max): 5V; Connect-Disconnect Life: 5千次; Core Colour: 黑色
X1 X3 = X32258MOB4SI: 晶振类型:贴片晶振;频率:8MHz;常温频差:±10ppm;外接负载电容:12pF;频率稳定度(全温):±20ppm;; LCSC Part Name: 8MHz ±10ppm 12pF; Supplier Part: C2682775; Manufacturer: YXC(扬兴晶振); Supplier Footprint: SMD3225-4P; JLCPCB Part Class: 扩展库; Datasheet: https://atta.szlcsc.com/upload/public/pdf/source/20240329/19D5F850207469550BEB00D7DFEDBC7A.pdf; Supplier: LCSC; Crystal Type: 贴片晶振; Normal temperature Frequency Tolerance: ±10ppm; External load capacitor: 12pF; Frequency Stability(Full temperature range): ±20ppm; Equivalent Series Resistance (ESR): 150Ω; Operating Temperature: -40℃~+85℃
FPC1 = AFC01-S10FCA-00: LCSC Part Name: 间距:0.5mm P数:10P 翻盖式 下接; Supplier Part: C262659; Manufacturer: JS(钜硕电子); Supplier Footprint: SMD,P=0.5mm,卧贴; JLCPCB Part Class: 扩展库; Datasheet: https://atta.szlcsc.com/upload/public/pdf/source/20190816/C413942_2A72D1AC756EAE17EEDF756A339D4500.pdf; Supplier: LCSC; Locking Feature: 翻盖式; Contact Type: 下接; Number of Contacts: 10P; Pitch: 0.5mm; Mounting Type: 卧贴; FFC, FCB Thickness: 0.3mm; Height Above Board: 2mm
TP1-TP4 = M3铜柱: Supplier: LCSC
U1 = W25Q64JVSSIQ_C83140: Supplier Part: C83140; Manufacturer: WINBOND(华邦); Supplier Footprint: SOP-8-208mil; JLCPCB Part Class: 扩展库; Datasheet: https://atta.szlcsc.com/upload/public/pdf/source/20161110/1478742546019.pdf; Supplier: LCSC
U15 = STM32F429ZGT6: LCSC Part Name: 带DSP和FPU的高性能高级系列ARM Cortex-M4 MCU，具有1 MB Flash、180 MHz CPU、ART加速器、Chrom-ART加速器、TFT、带SDRAM的FMC和TFT; Supplier Part: C46525; Manufacturer: ST(意法半导体); Supplier Footprint: LQFP-144(20x20); JLCPCB Part Class: 扩展库; Datasheet: https://atta.szlcsc.com/upload/public/pdf/source/20170102/1483323670635.pdf; Supplier: LCSC; CPU Core: ARM-M4; CPU Maximum Speed: 180MHz; Program Storage Size: 1MB; Number of I/O: 114; ADC (Bit): 12bit; DAC (Bit): 12bit; Low Voltage Detection Threshold: 1.8V~3.6V
X2 = 1TJF0SPDN1AI00A: 晶振类型:-;频率:-;外接负载电容:-;; LCSC Part Name: DST310S 32.768K 20PPM 7PF -40℃+85℃ 编带; Supplier Part: C213424; Manufacturer: KDS(大真空); Supplier Footprint: SMD3215-2P; JLCPCB Part Class: 扩展库; Datasheet: https://atta.szlcsc.com/upload/public/pdf/source/20180606/C213424_B74ABADA0A8AB01092557D8501E2CDD1.pdf; Supplier: LCSC

## Nets
AGND: C1.1 C7.1 C43.1 C44.1 C45.1 C46.2 C47.1 C48.2 C49.1 C51.1 C52.1 C53.2 C54.1 C57.1 C58.1 C60.1 C63.1 C64.1 C65.1 C66.2 C67.1 C69.1 R41.2 R43.2 R46.1 R48.1 R51.1 R55.1 R57.1 R60.1 R64.1 R68.1 R72.1 R74.1 R77.1 RF1.1 RF1.2 RF1.3 RF1.4 RF2.1 RF2.2 RF2.3 RF2.4 RF3.1 RF3.2 RF3.3 RF3.4 RF4.1 RF4.2 RF4.3 RF4.4 RF5.1 RF5.2 RF5.3 RF5.4 U7.1(ADJ/GND) U9.6(V–) U11.6(V–) U14.6(V–) U15.31(VSSA)
AVDD: C1.2 C7.2 C45.2 C46.1 C47.2 C52.2 C65.2 R44.2 R53.2 R70.2 U7.2(OUT) U7.4(OUT) U9.3(V+) U11.3(V+) U14.3(V+) U15.32(VREF+) U15.33(VDDA)
DVDD: C8.2 C9.2 C10.2 C11.2 C12.2 C13.2 C14.2 C15.2 C16.2 C17.2 C18.2 C19.2 C20.2 C21.2 C36.2 C37.1 FPC1.9 FPC1.10 R8.2 SW1.2 U1.8(VCC) U4.2(OUT) U4.4(OUT) U15.6(VBAT) U15.17(VDD) U15.30(VDD) U15.39(VDD) U15.52(VDD) U15.62(VDD) U15.72(VDD) U15.84(VDD) U15.95(VDD) U15.108(VDD) U15.121(VDD) U15.131(VDD) U15.144(VDD)
GND: C2.2 C3.2 C4.1 C5.1 C6.1 C8.1 C9.1 C10.1 C11.1 C12.1 C13.1 C14.1 C15.1 C16.1 C17.1 C18.1 C19.1 C20.1 C21.1 C22.2 C23.2 C24.1 C25.1 C26.1 C27.1 C28.2 C29.2 C30.1 C31.1 C32.1 C33.1 C34.1 C35.1 C36.1 C37.2 FPC1.1 FPC1.3 FPC1.8 FPC1.11 FPC1.12 H1.3 H2.3 H3.13 H4.13 H5.7 H6.7 LD3.1(C) LD5.3(VSS) R1.2 R3.1 R4.1 R9.1 R10.1 R16.1 R21.1 R22.2 R23.2 R24.1 R29.1 R40.2 R41.1 R42.2 R43.1 SW2.4 SW3.4 SW4.4 TP1.1(M3) TP2.1(M3) TP3.1(M3) TP4.1(M3) U1.4(GND) U2.2(GND) U3.8(VSS_A) U3.20(PB2BOOT1) U3.23(VSS_1) U3.35(VSS_2) U3.47(VSS_3) U4.1(ADJ/GND) U8.1 U8.37 U8.38 U10.2 U10.5 U10.6 U12.2 U12.5 U12.6 U13.2 U13.5 U13.6 U15.16(VSS) U15.38(VSS) U15.51(VSS) U15.61(VSS) U15.83(VSS) U15.94(VSS) U15.107(VSS) U15.120(VSS) U15.130(VSS) USB1.1(GND) USB1.12(GND) USB1.13(SHELL) USB1.14(SHELL) USB2.1(GND) USB2.12(GND) USB2.13(SHELL) USB2.14(SHELL) X1.2(GND) X1.4(GND) X3.2(GND) X3.4(GND)
VCC_5V: C34.2 C35.2 C39.1 C43.2 C44.2 D4.1(K) D5.2 H3.14 H4.14 H7.6 H7.7 L1.1 LD5.1(VDD) R7.1 R37.2 R39.1 U4.3(IN) U7.3(IN) U8.2 U10.1 U12.1 U13.1
VCC_IN: C40.2 C41.2 C42.2 D1.1(K) Q2.1(S) Q2.2(S) Q2.3(S) R36.2 U5.7(VIN)
ADC1_INN16: C49.2 R47.2 U15.35(PA1)
ADC1_INP16: C51.2 R50.2 U15.34(PA0-WKUP(PA0))
ADC2_INN10: C67.2 R73.2 U15.27(PC1)
ADC2_INP10: C69.2 R76.2 U15.26(PC0)
ADC3_INN1: C60.2 R63.2 U15.28(PC2)
ADC3_INP1: C54.2 R56.2 U15.29(PC3)
ADC_CLK: U8.18 U15.46(PB0)
ADC_DCO: U8.19
BOOT0: R1.1 SW1.4 U15.138(BOOT0)
DA0: U8.20 U15.114(PD0)
DA1: U8.21 U15.115(PD1)
DA2: U8.22 U15.116(PD2)
DA3: U8.23 U15.117(PD3)
DA4: U8.24 U15.118(PD4)
DA5: U8.25 U15.119(PD5)
DA6: U8.26 U15.122(PD6)
DA7: U8.27 U15.123(PD7)
DA8: U8.28 U15.77(PD8)
DA9: U8.29 U15.78(PD9)
DA10: U8.30 U15.79(PD10)
DA11: U8.31 U15.80(PD11)
DA12: U8.32 U15.81(PD12)
DA13: U8.33 U15.82(PD13)
DA14: U8.34 U15.85(PD14)
DA15: U8.35 U15.86(PD15)
DAC1_OUT1: R69.1 U15.40(PA4)
DAC1_OUT2: R58.1 U15.41(PA5)
DAC_CLK: U8.17 U15.47(PB1)
DAOF: U8.36 U15.76(PB15)
DB0: U8.16 U15.56(PG0)
DB1: U8.15 U15.57(PG1)
DB2: U8.14 U15.87(PG2)
DB3: U8.13 U15.88(PG3)
DB4: U8.12 U15.89(PG4)
DB5: U8.11 U15.90(PG5)
DB6: U8.10 U15.91(PG6)
DB7: U8.9 U15.92(PG7)
DB8: U8.8 U15.93(PG8)
DB9: U8.7 U15.124(PG9)
DB10: U8.6 U15.125(PG10)
DB11: U8.5 U15.126(PG11)
DB12: U8.4 U15.127(PG12)
DB13: U8.3 U15.128(PG13)
DCDC_GND: C39.2 C40.1 C41.1 C42.1 CN1.1(-) D2.1 D3.2(A) D5.1 LD4.1(C) R35.1 R38.1 R40.1 R42.1 U5.6(GND) U5.9(EP)
KEY_0: SW3.1 U15.141(PE0)
KEY_1: SW4.1 U15.142(PE1)
LCD_BL: FPC1.4 U15.113(PC12)
LCD_DC: FPC1.5 U15.111(PC10)
LK_3V3: C26.2 C30.2 C31.2 C32.2 C33.2 H1.4 LD1.4 LD2.2 LD2.4 Q1.3(C) R18.1 R25.2 R26.2 R27.2 U2.5(VOUT) U3.1(VBAT) U3.9(VDD_A) U3.24(VDD_1) U3.36(VDD_2) U3.48(VDD_3)
LK_5V: C24.2 D4.2(A) F1.2 R11.2 U2.1(VIN) U2.3(EN)
LK_AIN: R27.1 R29.2 U3.10(PA0_WKUPUSART2_CTSADC12_IN0TIM2_CH1_ETR)
LK_JTCK: R32.1 U3.15(PA5SPI1_SCKADC12_IN5) U3.26(PB13SPI2_SCKUSART3_CTSTIM1_CH1N)
LK_JTMS: R28.1 R33.1 U3.27(PB14SPI2_MISOUSART3_RTSTIM1_CH2N)
LK_LED: LD1.2 R12.1 U3.30(PA9USART1_TXTIM1_CH2)
LK_NRST: R34.1 U3.18(PB0ADC12_IN8TIM3_CH3)
LK_OSC_IN: C29.1 U3.5(PD0-OSC_IN) X3.3
LK_OSC_OUT: C28.1 U3.6(PD1-OSC_OUT) X3.1
LK_RESET: C27.2 R26.1 U3.7(NRST)
LK_RX: R19.1 R31.1 U3.13(PA3USART2_RXADC12_IN3TIM2_CH4)
LK_SWCLK: H1.1 U3.37(PA14JTCKSWCLK)
LK_SWDIO: H1.2 U3.34(PA13JTMSSWDIO)
LK_TX: R15.1 R30.1 U3.12(PA2USART2_TXADC12_IN2TIM2_CH3)
LK_USB_DM: R13.1 USB2.5(DN2) USB2.7(DN1)
LK_USB_DP: R14.1 R20.1 USB2.6(DP1) USB2.8(DP2)
LK_USB_M: R13.2 U3.32(PA11USART1_CTSCAN_RXTIM1_CH4USBDM)
LK_USB_P: R14.2 U3.33(PA12USART1_RTSCAN_TXTIM1_ETRUSBDP)
LK_USB_RENU: R17.2 U3.38(PA15JTDI)
LK_VBUS: F1.1 USB2.2(VBUS) USB2.11(VBUS)
NRST: R2.2 R34.2 U15.25(NRST)
OCTOSPIM_P1_CLK: U1.6(CLK) U15.22(PF10)
OCTOSPIM_P1_IO0: U1.2(DO) U15.20(PF8)
OCTOSPIM_P1_IO1: U1.5(DI) U15.21(PF9)
OCTOSPIM_P1_IO2: U1.3(IO2) U15.19(PF7)
OCTOSPIM_P1_IO3: U1.7(IO3) U15.18(PF6)
OCTOSPIM_P1_NCS: U1.1(CS#) U15.64(PE11)
OPAMP1_VOUT: R61.1 U15.44(PC4)
OPAMP2_VOUT: R66.1 U15.58(PE7)
OSC32_IN: C4.2 U15.8(PC14-OSC32_IN(PC14)) X2.2(OSC2)
OSC32_OUT: C6.2 U15.9(PC15-OSC32_OUT(PC15)) X2.1(OSC1)
OSC_IN: C3.1 U15.23(PH0-OSC_IN(PH0)) X1.3
OSC_OUT: C2.1 U15.24(PH1-OSC_OUT(PH1)) X1.1
PA2: H4.9 U15.36(PA2)
PA3: H3.9 U15.37(PA3)
PA6: H4.8 U15.42(PA6)
PA7: H3.6 U15.43(PA7)
PA8: H3.10 U15.100(PA8)
PA11: R5.1 U15.103(PA11)
PA12: R6.1 U15.104(PA12)
PA15: FPC1.6 U15.110(PA15(JTDI))
PB2: H4.3 U15.48(PB2-BOOT1(PB2))
PB3: FPC1.2 U15.133(PB3(JTDOTRACESWO))
PB4: H7.5 U15.134(PB4(NJTRST))
PB5: FPC1.7 U15.135(PB5)
PB6: H6.5 U15.136(PB6)
PB7: H5.5 U15.137(PB7)
PB8: H7.4 U15.139(PB8)
PB9: LD5.4(DIN) U15.140(PB9)
PB10: U10.4 U15.69(PB10)
PB11: U10.3 U15.70(PB11)
PB12: H4.11 U15.73(PB12)
PB13: H3.12 U15.74(PB13)
PB14: H4.12 U15.75(PB14)
PC5: H4.5 U15.45(PC5)
PC6: U12.4 U15.96(PC6)
PC7: U12.3 U15.97(PC7)
PC8: H3.11 U15.98(PC8)
PC9: H4.10 U15.99(PC9)
PC11: H6.4 U15.112(PC11)
PC13: H5.2 U15.7(PC13)
PE2: U13.3 U15.1(PE2)
PE3: U13.4 U15.2(PE3)
PE4: H7.1 U15.3(PE4)
PE5: H6.1 U15.4(PE5)
PE6: H5.1 U15.5(PE6)
PE8: H4.4 U15.59(PE8)
PE9: H3.5 U15.60(PE9)
PE10: H3.4 U15.63(PE10)
PE12: H4.6 U15.65(PE12)
PE13: H3.7 U15.66(PE13)
PE14: H4.7 U15.67(PE14)
PE15: H3.8 U15.68(PE15)
PF0: H6.2 U15.10(PF0)
PF1: H7.2 U15.11(PF1)
PF2: H5.3 U15.12(PF2)
PF3: H6.3 U15.13(PF3)
PF4: H7.3 U15.14(PF4)
PF5: H5.4 U15.15(PF5)
PF11: H3.3 U15.49(PF11)
PF12: H4.2 U15.50(PF12)
PF13: H3.1 U15.53(PF13)
PF14: H4.1 U15.54(PF14)
PF15: H3.2 U15.55(PF15)
PG14: H6.6 U15.129(PG14)
PG15: H5.6 U15.132(PG15)
SWCLK: R32.2 U15.109(PA14(JTCK-SWCLK))
SWDIO: R33.2 U15.105(PA13(JTMS-SWDIO))
USART1_RX: H2.1 R30.2 U15.102(PA10)
USART1_TX: H2.2 R31.2 U15.101(PA9)
USB_DM: R5.2 USB1.5(DN2) USB1.7(DN1)
USB_DP: R6.2 R7.2 USB1.6(DP1) USB1.8(DP2)
$1N10580: C5.2 R2.1 SW2.2
$1N10637: C22.1 U15.71(VCAP_1)
$1N10687: C23.1 U15.106(VCAP_2)
$1N10713: R8.1 U15.143(PDR_ON)
$1N12725: R3.2 USB1.4(CC1)
$1N12729: R4.2 USB1.10(CC2)
$2N815: C38.1 D3.1(K) L1.2 U5.8(PH)
$2N844: C38.2 U5.1(BOOT)
$2N1364: R37.1 R38.2 U5.4(VSENSE)
$2N8114: LD4.2(A) R39.2
$2N19448: CN1.2(+) D2.2 Q2.5(D) Q2.6(D) Q2.7(D) Q2.8(D) Q2.9(D)
$2N19501: D1.2(A) Q2.4(G) R35.2 R36.1
$3N2031: R22.1 U3.2(PC13-TAMPER-RTC)
$3N2032: R23.1 U3.3(PC14-OSC32_IN)
$3N2056: R24.2 U3.44(BOOT0)
$3N2076: R28.2 U3.25(PB12SPI2_NSSI2C2_SMBAUSART3_CKTIM1_BKIN)
$3N2126: Q1.2(E) R20.2
$3N2131: Q1.1(B) R11.1 R17.1 R21.2
$3N2867: R10.2 USB2.4(CC1)
$3N2870: R16.2 USB2.10(CC2)
$3N3979: LD3.2(A) R18.2
$3N4144: R25.1 U3.39(PB3JTDO)
$3N6987: C25.2 U2.4(BP)
$3N14022: LD1.3 R12.2
$3N14147: LD1.1 R9.2
$3N14217: LD2.3 R19.2
$3N14219: LD2.1 R15.2
$5N1760: C59.2 R62.1 R64.2
$5N1764: C59.1 RF3.5
$5N1766: R63.1 R65.2 U11.5(–OUT)
$5N1770: C53.1 R53.1 R57.2 U11.2(VOCM)
$5N1771: R62.2 R65.1 U11.8(+IN)
$5N1778: R71.2 R73.1 U14.4(+OUT)
$5N1780: C68.2 R75.1 R77.2
$5N1785: R76.1 R78.2 U14.5(–OUT)
$5N1786: C68.1 RF5.5
$5N1787: R75.2 R78.1 U14.8(+IN)
$5N1790: R71.1 R72.2 U14.1(–IN)
$5N1791: C66.1 R70.1 R74.2 U14.2(VOCM)
$5N1793: R54.2 R56.1 U11.4(+OUT)
$5N1794: R54.1 R55.2 U11.1(–IN)
$5N1798: R50.1 R52.2 U9.5(–OUT)
$5N1799: R45.1 R46.2 U9.1(–IN)
$5N1800: R45.2 R47.1 U9.4(+OUT)
$5N1803: R49.2 R52.1 U9.8(+IN)
$5N1811: C50.2 R49.1 R51.2
$5N1812: C48.1 R44.1 R48.2 U9.2(VOCM)
$5N1815: C50.1 RF1.5
$5N2754: C61.2 R68.2 RF4.5
$5N2756: C55.2 R60.2 RF2.5
$5N2759: C55.1 C58.2 L3.2
$5N2762: C57.2 L3.1 R58.2 R61.2
$5N2765: C63.2 L5.1 R66.2 R69.2
$5N2768: C61.1 C64.2 L5.2

Not connected (* = marked no-connect by the designer): CN1 3* 4*; LD5 2(DOUT)*; SW1 1* 3*; SW2 1* 3*; SW3 2* 3*; SW4 2* 3*; U3 4(PC15-OSC32_OUT) 11(PA1USART2_RTSADC12_IN1TIM2_CH2) 14(PA4SPI1_NSSUSART2_CKADC12_IN4) 16(PA6SPI1_MISOADC12_IN6TIM3_CH1) 17(PA7SPI1_MOSIADC12_IN7TIM3_CH2) 19(PB1ADC12_IN9TIM3_CH4) 21(PB10I2C2_SCLUSART3_TX) 22(PB11I2C2_SDAUSART3_RX-) 28(PB15SPI2_MOSITIM1_CH3N) 29(PA8USART1_CKTIM1_CH1MCO) 31(PA10USART1_RXTIM1_CH3) 40(PB4NJTRST) 41(PB5I2C1_SMBA) 42(PB6I2C1_SCLTIM4_CH1) 43(PB7I2C1_SDATIM4_CH2) 45(PB8TIM4_CH3) 46(PB9TIM4_CH4); U5 2(NC)* 3(NC)* 5(ENA)*; U8 39* 40*; U9 7(NIC)*; U11 7(NIC)*; U14 7(NIC)*; USB1 2(VBUS)* 3(SBU2)* 9(SBU1)* 11(VBUS)*; USB2 3(SBU2)* 9(SBU1)*

## Notes on the sheets
sheet 1
- P95
sheet 4
- ADC_DCO 外接引脚
